# EAGLE design reflow (EAGLE 7.1.0)
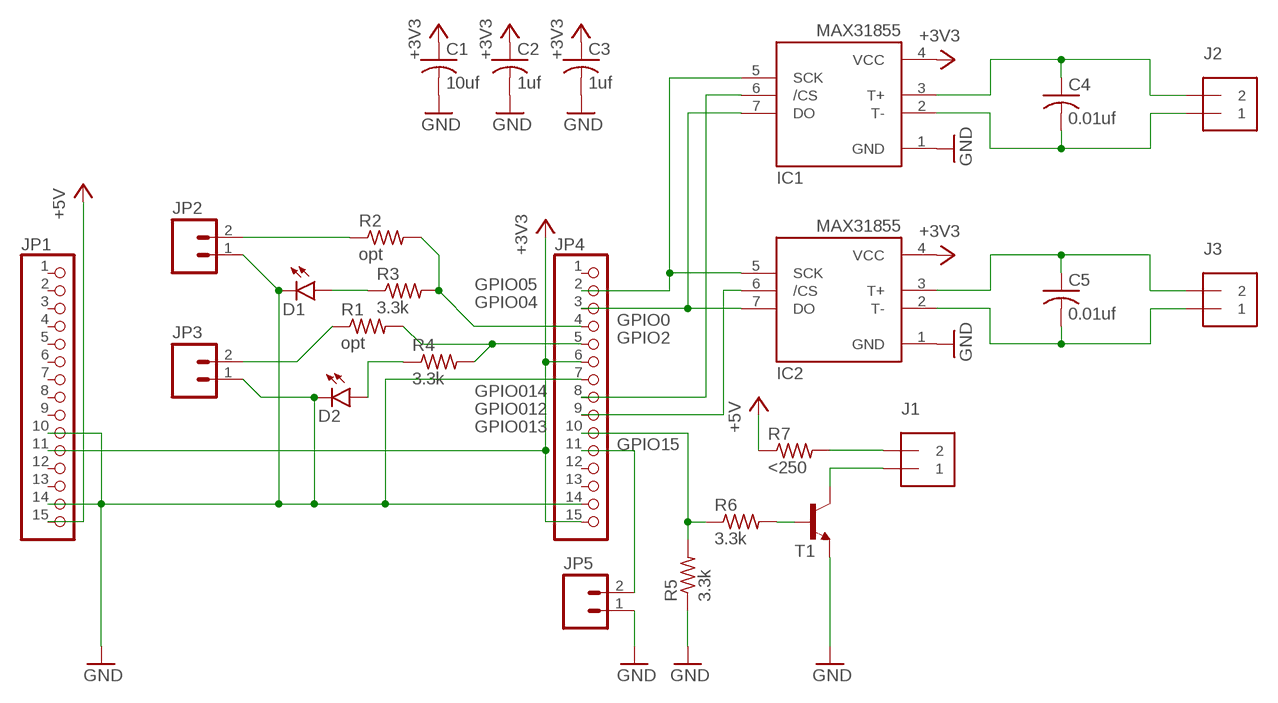
[diagram p0: schematic, sheet 1]

## Parts
C1  10uf  C-USC0603  [C0603]
C2  1uf  C-USC0603  [C0603]
C3  1uf  C-USC0603  [C0603]
C4  0.01uf  C-USC0603  [C0603]
C5  0.01uf  C-USC0603  [C0603]
D1  LED0603  [LED-0603]
D2  LED0603  [LED-0603]
IC1  MAX31855  MAX6675  [SO08]
IC2  MAX31855  MAX6675  [SO08]
J1  1X2-3.5MM  [1X2-3.5MM]
J2  1X2-3.5MM  [1X2-3.5MM]
J3  1X2-3.5MM  [1X2-3.5MM]
JP1  PINHD-1X15  [1X15]
JP2  M02PTH  [1X02]
JP3  M02PTH  [1X02]
JP4  PINHD-1X15  [1X15]
JP5  M02PTH  [1X02]
R1  opt  R-US_R0603  [R0603]
R2  opt  R-US_R0603  [R0603]
R3  3.3k  R-US_R0603  [R0603]
R4  3.3k  R-US_R0603  [R0603]
R5  3.3k  R-US_R0603  [R0603]
R6  3.3k  R-US_R0603  [R0603]
R7  <250  R-US_R0603  [R0603]
T1  MMBT3904LT1-NPN-SOT23-BEC  [SOT23-BEC]

## Nets
+3V3: C1.1 C2.1 C3.1 IC1.4(VCC) IC2.4(VCC) JP1.11 JP4.6 JP4.15
+5V: JP1.15 R7.1
GND: C1.2 C2.2 C3.2 D1.C D2.C IC1.1(GND) IC2.1(GND) JP1.10 JP1.14 JP2.1 JP3.1 JP4.7 JP4.14 JP5.1 R5.1 T1.E
N$1: C5.2 IC2.2(T-) J3.1
N$2: C4.2 IC1.2(T-) J2.1
N$3: C4.1 IC1.3(T+) J2.2
N$4: IC1.5(SCK) IC2.5(SCK) JP4.2
N$5: C5.1 IC2.3(T+) J3.2
N$6: IC1.7(DO) IC2.7(DO) JP4.3
N$7: IC1.6(/CS) JP4.8
N$8: IC2.6(/CS) JP4.9
N$9: J1.2 R7.2
N$10: J1.1 T1.C
N$11: JP4.10 R5.2 R6.1
N$12: JP2.2 R2.1
N$13: D2.A R4.1
N$14: D1.A R3.1
N$15: JP3.2 R1.1
N$16: JP4.11 JP5.2
N$19: JP4.4 R2.2 R3.2
N$20: JP4.5 R1.2 R4.2
N$27: R6.2 T1.B
Unconnected: JP1.1 JP1.2 JP1.3 JP1.4 JP1.5 JP1.6 JP1.7 JP1.8 JP1.9 JP1.12 JP1.13 JP4.1 JP4.12 JP4.13

## Notes on the sheet
- J2
- J3
- GPIO05
- GPIO04
- GPIO0
- GPIO2
- GPIO014
- GPIO012 | J1
- GPIO013
- GPIO15

## Library data of the parts
C1-C5 = resistor:C-US: CAPACITOR, American symbol
D1 D2 = SparkFun-LED:LED: LEDs Standard schematic elements and footprints for 5mm, 3mm, 1206, and 0603 sized LEDs. 5mm - Spark Fun Electronics SKU : COM-00529 (and others)
IC1 IC2 = adafruit:MAX6675
J1-J3 = adafruit:1X2: 3.5mm Terminal block http://www.ladyada.net/library/pcb/eaglelibrary.html
JP1 JP4 = pinhead:PINHD-1X15: PIN HEADER
JP2 JP3 JP5 = SparkFun-Connectors:M02: Standard 2-pin 0.1" header. Use with - straight break away headers ( PRT-00116) - right angle break away headers (PRT-00553) - swiss pins (PRT-00743) - machine pins (PRT-00117) - female headers (PRT-00115) Molex polarized connector foot print use with: PRT-08233 with associated crimp pins and housings. 2.54_SCREWTERM for use with PRT-10571. 3.5mm Screw Terminal footprints for PRT-08084 5mm Screw Terminal footprints for use with PRT-08432
R1-R7 = resistor:R-US_: RESISTOR, American symbol
T1 = transistor-neu-to92:*-NPN-: NPN Transistror; MPN: MMBT2222A

## Net classes
0 default: width 0.305 mm, clearance 0.356 mm

## Board
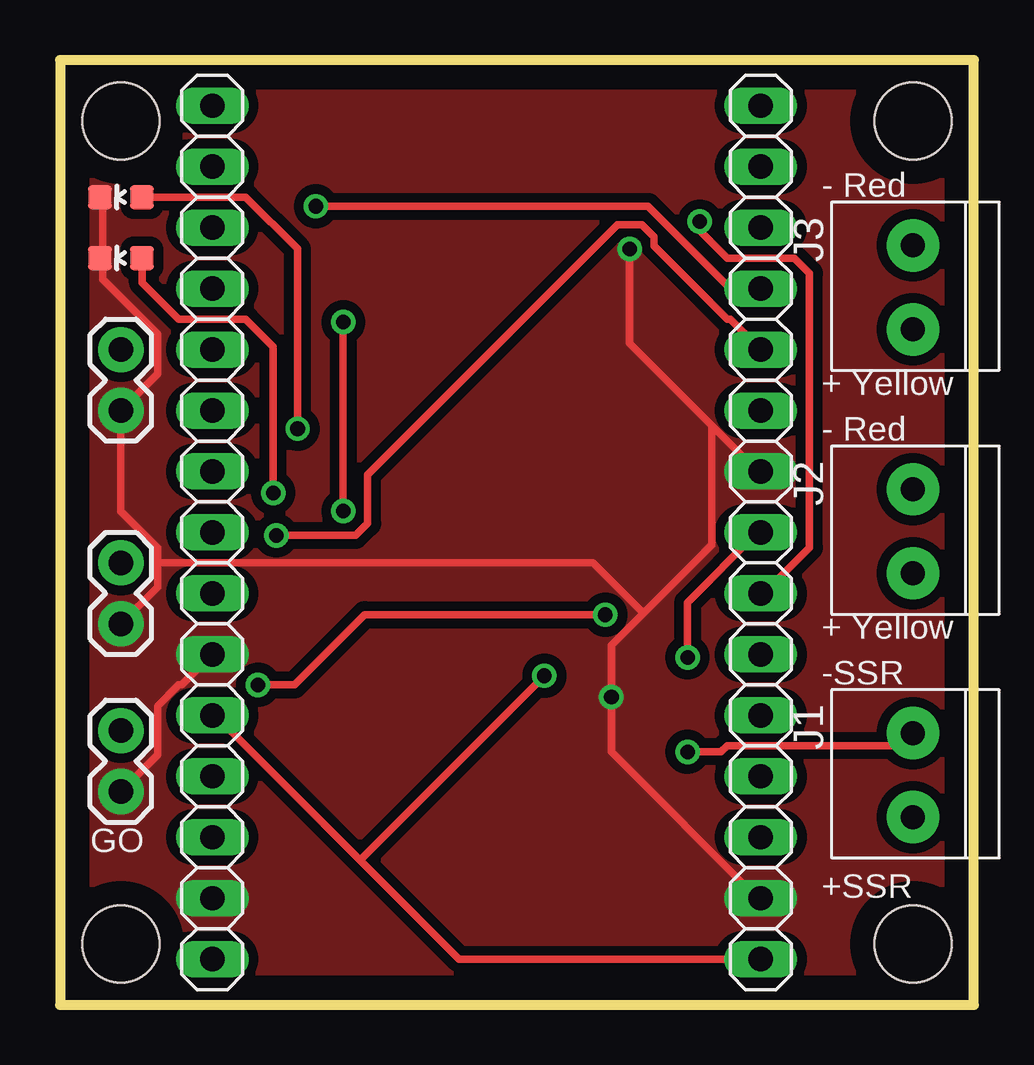
[diagram p1: board, top side]
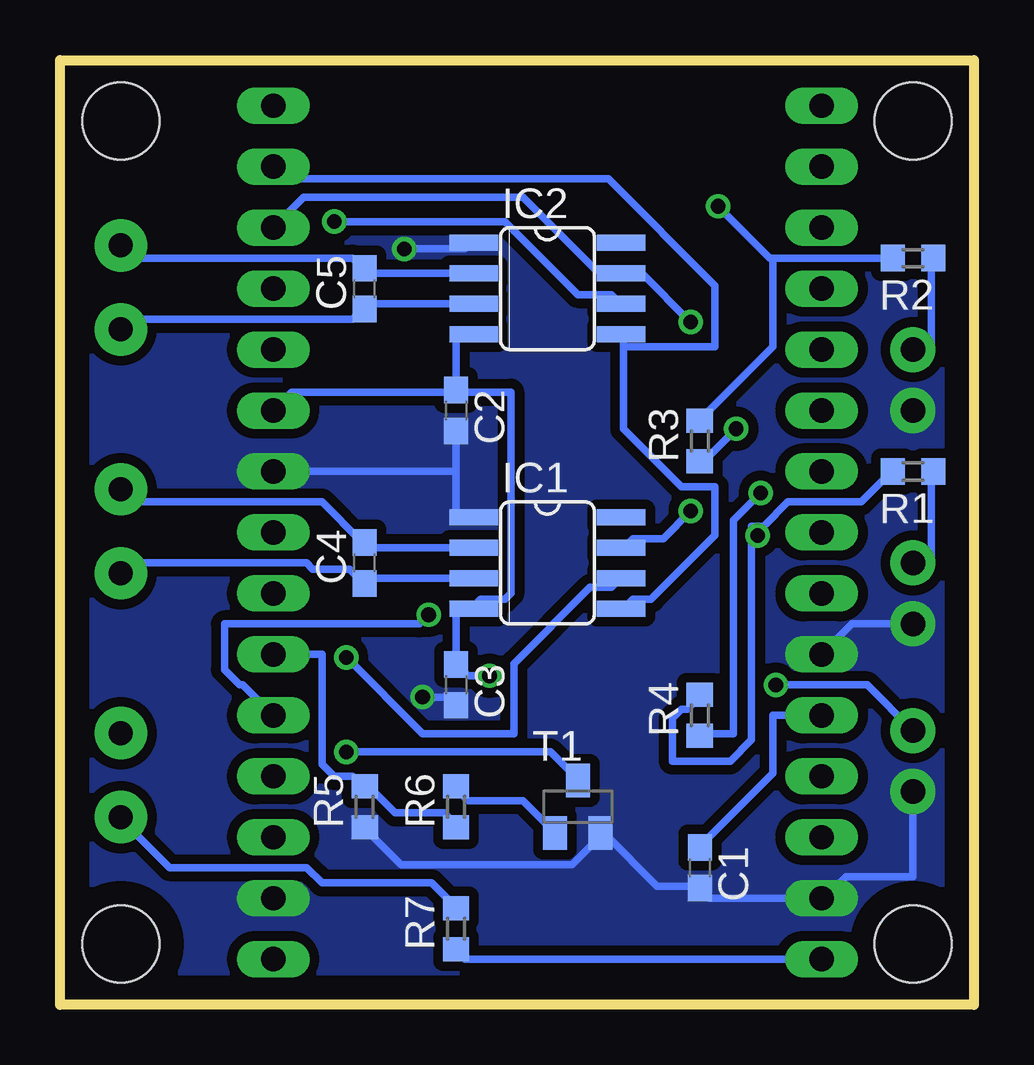
[diagram p2: board, bottom side, seen from below]

Size 38.1 x 39.37 mm. Coordinates in mm from the lower left corner, seen from the top.
Outline: 0,0 38.1,0 38.1,39.37 0,39.37 0,0
Copper layers (1*16): Top 0.035mm / dielectric 1.5mm / Bottom 0.035mm
Design rules "default *": minimum track width 10mil, minimum drill 24mil, track to track 8mil, track to pad 8mil, pad to pad 8mil, via to via 8mil, smd to smd 8mil, copper to edge 40mil, drill to drill 8mil, minimum pad ring 10mil, minimum via ring 8mil, stop-mask expansion 4mil, vias tented up to drill 25mil, thermal gap 10mil
Holes 3.2 mm at 2.54,36.83 2.54,2.54 35.56,36.83 35.56,2.54

### Footprints (pad centres in the part's own frame; a part is rotated, then mirrored left to right if it is on the bottom)
C0603 = smd 1.1 x 1: 1 -0.85,0; 2 0.85,0
LED-0603 = smd 1 x 1: A 0,-0.877; C 0,0.877
SO08 = smd 0.66 x 2.032: 1 -1.905,-3.073; 2 -0.635,-3.073; 3 0.635,-3.073; 4 1.905,-3.073; 5 1.905,3.073; 6 0.635,3.073; 7 -0.635,3.073; 8 -1.905,3.073
1X2-3.5MM = drill 1 pad 2.184: 1 1.8,0; 2 -1.7,0
1X15 = drill 1.016 long: 1 -17.78,0; 2 -15.24,0; 3 -12.7,0; 4 -10.16,0; 5 -7.62,0; 6 -5.08,0; 7 -2.54,0; 8 0,0; 9 2.54,0; 10 5.08,0; 11 7.62,0; 12 10.16,0; 13 12.7,0; 14 15.24,0; 15 17.78,0
1X02 = drill 1.016 pad 1.88: 1 0,0; 2 2.54,0
R0603 = smd 1 x 1.1: 1 -0.85,0; 2 0.85,0
SOT23-BEC = smd 1 x 1.4: B -0.95,-1.1; C 0,1.1; E 0.95,-1.1

### Placement (x,y rotation side)
C1  11.43,5.71 270 bottom
C2  21.59,24.77 270 bottom
C3  21.59,13.34 270 bottom
C4  25.4,18.41 90 bottom
C5  25.4,29.84 90 bottom
D1  2.54,33.66 90 top
D2  2.54,31.11 90 top
IC1  17.78,18.41 270 bottom
IC2  17.78,29.84 270 bottom
J1  35.56,9.53 90 top
J2  35.56,19.68 90 top
J3  35.56,29.84 90 top
JP1  6.35,19.68 270 top
JP2  2.54,24.77 90 top
JP3  2.54,15.88 90 top
JP4  29.21,19.68 270 top
JP5  2.54,8.89 90 top
R1  2.54,22.23 180 bottom
R2  2.54,31.11 180 bottom
R3  11.43,23.5 90 bottom
R4  11.43,12.06 90 bottom
R5  25.4,8.26 90 bottom
R6  21.59,8.26 90 bottom
R7  21.59,3.17 90 bottom
T1  16.51,8.26 0 bottom

### Tracks (layer width: path | path; a pad name or v marks a point on that pad's centre or on a via)
+3V3  (via drill 0.61)
  Top 0.305: JP4.15 16.64,1.91 12.51,6.03 | 12.51,6.03 6.48,12.06 JP1.11 | 12.51,6.03 v20.19,13.72
  Bottom 0.305: C2.1 21.59,27.94 IC2.4 | C2.1 21.46,25.53 19.3,25.53 19.3,17.14 19.56,16.89 20.57,16.89 20.83,16.64 IC1.4 21.59,16.51 C3.1 21.46,14.1 21.08,13.72 v20.19,13.72 | JP4.6 28.45,25.53 21.72,25.53 C2.1 | JP1.11 8.38,12.06 8.38,9.65 11.43,6.6 C1.1
+5V
  Bottom 0.305: JP1.15 21.21,1.91 21.59,2.29 R7.1
GND  (via drill 0.61)
  Top 0.305: JP4.14 29.08,4.45 22.99,10.54 v22.99,12.83 22.99,14.99 24.32,16.32 | v23.75,31.5 23.75,27.56 27.24,24.07 | 27.24,24.07 29.08,22.23 JP4.7 | 24.32,16.32 27.18,19.18 27.18,24 27.24,24.07 | D1.C 1.78,33.66 1.78,31.11 D2.C 1.78,30.99 1.78,30.23 4.06,27.94 4.06,26.29 JP2.1 2.54,20.57 4.06,19.05 4.06,18.41 | JP1.10 5.08,13.34 4.95,13.34 4.06,12.45 4.06,10.41 JP5.1 | 4.06,18.41 4.06,17.4 JP3.1 | 24.32,16.32 22.23,18.41 4.06,18.41
  Bottom 0.305: v22.99,12.83 21.84,12.83 21.59,12.57 C3.2 | 21.59,22.23 21.59,20.32 IC1.1 | 21.59,22.23 C2.2 | v23.75,31.5 21.21,31.5 20.95,31.75 IC2.1 | JP4.7 21.59,22.23 | JP1.10 5.08,15.88 JP3.1 | R5.1 25.4,7.37 23.88,5.84 16.76,5.84 15.49,7.11 T1.E 15.37,7.11 13.21,4.95 11.56,4.95 C1.2 11.43,4.83 11.05,4.45 JP1.14 6.22,4.45 5.33,5.33 2.54,5.33 JP5.1
  pour Bottom (isolate 0.406, no thermals): -1.27,40.64 39.37,40.64 39.37,-1.27 -1.27,-1.27
  pour Top (isolate 0.406, no thermals): -2.54,41.91 40.64,41.91 40.64,-2.54 -2.54,-2.54
N$1
  Bottom 0.305: IC2.2 25.27,30.48 25.4,30.61 C5.2 25.53,30.73 25.91,31.11 35.05,31.11 35.56,31.62 J3.1
N$2
  Bottom 0.305: IC1.2 25.27,19.05 25.4,19.18 C4.2 25.53,19.3 27.18,20.95 35.05,20.95 35.56,21.46 J2.1
N$3
  Bottom 0.305: IC1.3 25.27,17.78 25.4,17.65 C4.1 25.53,17.65 26.04,18.16 27.56,18.16 27.81,18.41 35.18,18.41 35.56,18.03 J2.2
N$4
  Bottom 0.305: 14.61,27.43 14.61,27.94 IC2.5 | 14.61,27.43 14.61,24 12.19,21.59 10.79,21.59 10.79,19.56 13.46,16.89 14.22,16.89 14.61,16.51 IC1.5 | JP4.2 28.7,34.42 15.24,34.42 10.79,29.97 10.79,27.43 14.61,27.43
N$5
  Bottom 0.305: IC2.3 25.27,29.21 25.4,29.08 C5.1 25.53,28.96 25.91,28.57 35.18,28.57 35.56,28.19 J3.2
N$6  (via drill 0.61)
  Top 0.305: v11.81,28.45 v11.81,20.57
  Bottom 0.305: v11.81,20.57 12.95,19.43 14.22,19.43 14.61,19.05 IC1.7 | v11.81,28.45 13.84,30.48 IC2.7 14.73,30.61 15.75,30.61 18.8,33.66 27.94,33.66 JP4.3
N$7  (via drill 0.61)
  Top 0.305: v26.16,14.48 26.16,16.76 29.08,19.68 JP4.8
  Bottom 0.305: v26.16,14.48 22.99,11.3 19.18,11.3 19.18,14.22 16,17.4 15.11,17.4 14.73,17.78 IC1.6
N$8  (via drill 0.61)
  Top 0.305: v26.67,32.64 26.67,32.26 27.81,31.11 30.61,31.11 31.24,30.48 31.24,19.05 29.34,17.14 JP4.9
  Bottom 0.305: v26.67,32.64 19.56,32.64 16.51,29.59 15.11,29.59 14.73,29.21 IC2.6
N$9
  Bottom 0.305: R7.2 21.59,4.06 22.61,5.08 27.18,5.08 27.81,5.71 33.53,5.71 35.56,7.75 J1.2
N$10  (via drill 0.61)
  Top 0.305: v26.16,10.54 27.56,10.54 27.81,10.79 35.05,10.79 35.56,11.3 J1.1
  Bottom 0.305: v26.16,10.54 17.65,10.54 16.51,9.4 T1.C
N$11
  Bottom 0.305: R6.1 21.59,7.49 22.1,8 24.13,8 25.15,9.02 25.4,9.02 R5.2 25.53,9.14 25.91,9.53 26.67,9.53 27.18,10.03 27.18,14.61 JP4.10
N$12
  Bottom 0.305: JP2.2 1.78,27.3 1.78,31.11 R2.1
N$13  (via drill 0.61)
  Top 0.305: v8.89,21.34 8.89,27.43 7.75,28.57 4.95,28.57 3.43,30.1 D2.A
  Bottom 0.305: v8.89,21.34 10.03,20.19 10.03,11.3 11.43,11.3 R4.1
N$14  (via drill 0.61)
  Top 0.305: D1.A 7.75,33.66 9.91,31.5 v9.91,24
  Bottom 0.305: v9.91,24 11.18,22.73 11.43,22.73 R3.1
N$15
  Bottom 0.305: JP3.2 1.78,18.41 1.78,22.23 R1.1
N$16  (via drill 0.61)
  Top 0.305: v22.73,16.26 12.7,16.26 9.78,13.34 v8.26,13.34
  Bottom 0.305: JP4.11 30.48,13.34 30.61,13.34 31.24,13.97 31.24,15.88 23.11,15.88 v22.73,16.26 | v8.26,13.34 4.45,13.34 JP5.2
N$19  (via drill 0.61)
  Top 0.305: JP4.4 27.94,29.84 24.51,33.27 v10.67,33.27
  Bottom 0.305: 8.38,31.11 8.38,27.43 11.43,24.38 R3.2 | R2.2 8.38,31.11 | v10.67,33.27 8.51,31.11 8.38,31.11
N$20  (via drill 0.61)
  Top 0.305: JP4.5 27.94,28.57 27.81,28.57 24.77,31.62 24.77,32 24.26,32.51 23.24,32.51 12.83,22.1 12.83,20.07 12.32,19.56 v9.02,19.56
  Bottom 0.305: 9.27,19.56 9.27,19.94 8.76,19.94 7.75,20.95 4.7,20.95 3.43,22.23 R1.2 | 9.27,19.56 9.27,11.05 10.16,10.16 12.57,10.16 12.57,11.94 12.19,12.32 11.94,12.32 11.43,12.83 R4.2 | v9.02,19.56 9.27,19.56
N$27
  Bottom 0.305: R6.2 21.59,9.02 21.08,8.51 18.8,8.51 17.53,7.24 T1.B

### Text on the board
tPlace: -SSR | GO
tNames: - Red | + Yellow | - Red | + Yellow | +SSR